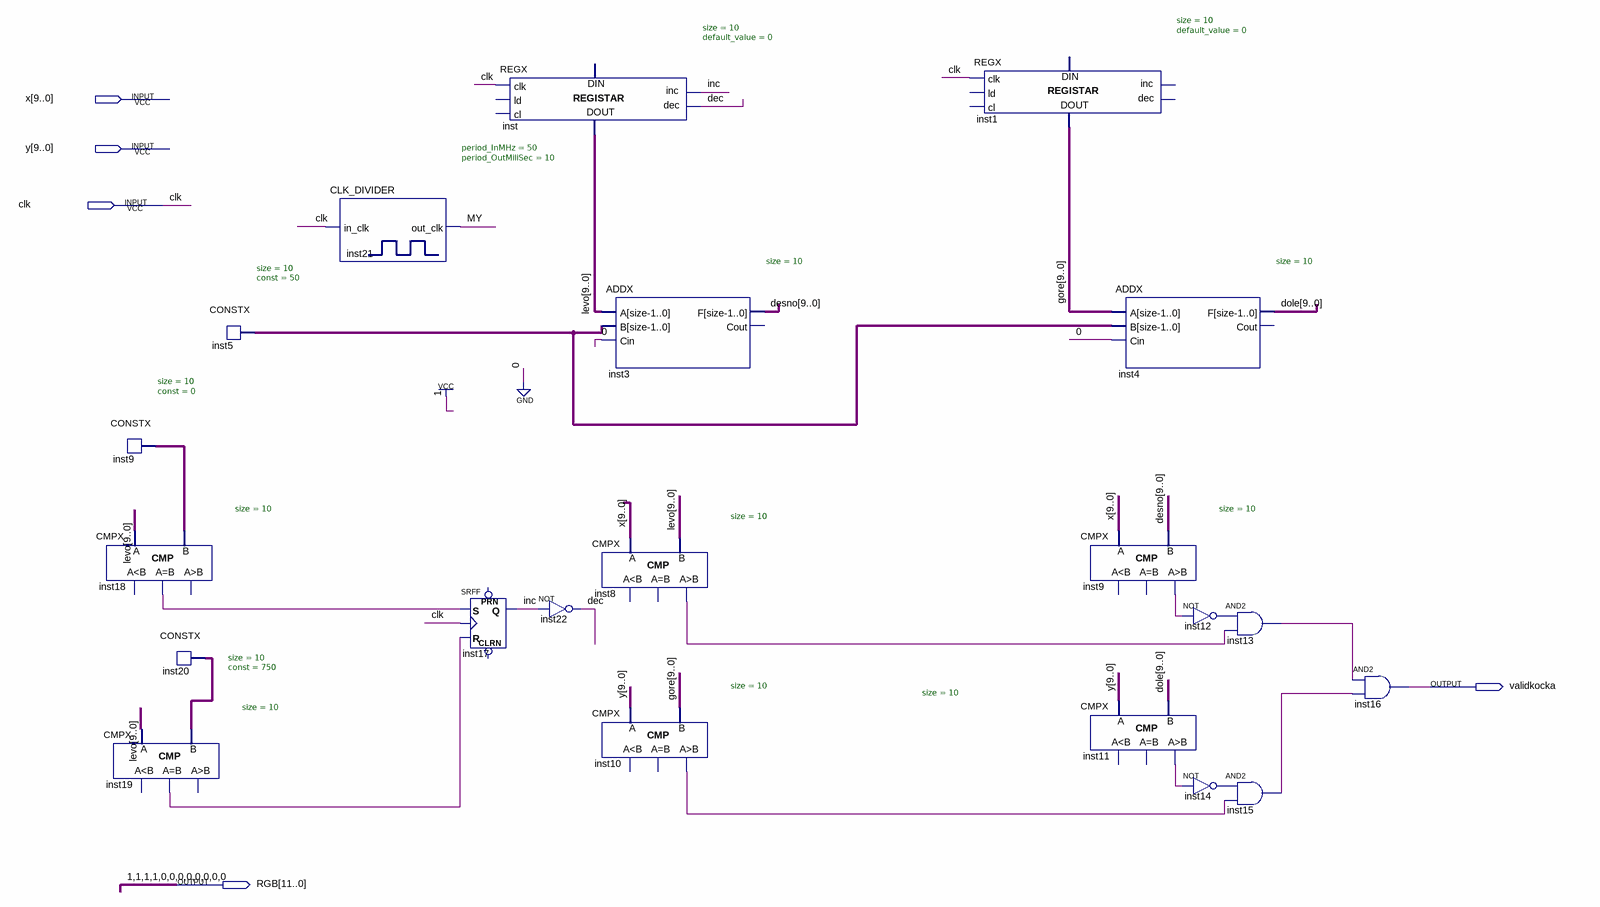
[diagram p0: schematic sheet]
// Quartus schematic kockalevodesno.bdf as structural Verilog: 21 symbols, 5 pins
module kockalevodesno (
  input  [9:0] x,
  input  [9:0] y,
  input  clk,
  output validkocka,
  output [11:0] RGB
);

  wire dec, inc, inst8_gr, inst9_gr, inst10_gr, inst11_gr, inst12_out, inst13_out, inst14_out, inst15_out,
       inst18_eq, inst19_eq, MY;
  wire [9:0] desno, dole, gore, inst5_data, inst9_data, inst20_data, levo;

  CONSTX #(.size(10), .\const (0)) inst9 (.data(inst9_data));
  CMPX #(.size(10)) inst18 (.A(levo), .B(inst9_data), .eq(inst18_eq));  // open: ls, gr
  CMPX #(.size(10)) inst19 (.B(inst20_data), .eq(inst19_eq));  // open: A, ls, gr
  CONSTX #(.size(10), .\const (750)) inst20 (.data(inst20_data));
  CONSTX #(.size(10), .\const (50)) inst5 (.data(inst5_data));
  CLK_DIVIDER #(.period_InMHz(50), .period_OutMiliSec(10)) inst21 (.in_clk(clk), .out_clk(MY));
  SRFF inst17 (.S(inst18_eq), .R(inst19_eq), .CLK(clk), .Q(inc));  // open: PRN, CLRN
  REGX #(.size(10), .default_value(0)) inst (
    .clk(clk), .inc(inc), .dec(dec), .data_out(levo));  // open: ld, cl, data_in
  not inst22 (dec, inc);
  ADDX #(.size(10)) inst3 (.A(levo), .B(inst5_data), .Cin(1'b0), .F(desno));  // open: Cout
  CMPX #(.size(10)) inst8 (.A(x), .B(levo), .gr(inst8_gr));  // open: ls, eq
  CMPX #(.size(10)) inst10 (.A(y), .B(gore), .gr(inst10_gr));  // open: ls, eq
  REGX #(.size(10), .default_value(0)) inst1 (.clk(clk), .data_out(gore));  // open: ld, cl, inc, dec, data_in
  CMPX #(.size(10)) inst9_dup2 (.A(x), .B(desno), .gr(inst9_gr));  // open: ls, eq
  CMPX #(.size(10)) inst11 (.A(y), .B(dole), .gr(inst11_gr));  // open: ls, eq
  ADDX #(.size(10)) inst4 (.A(gore), .B(inst5_data), .Cin(1'b0), .F(dole));  // open: Cout
  not inst12 (inst12_out, inst9_gr);
  not inst14 (inst14_out, inst11_gr);
  and inst13 (inst13_out, inst12_out, inst8_gr);
  and inst15 (inst15_out, inst14_out, inst10_gr);
  and inst16 (validkocka, inst13_out, inst15_out);

  assign RGB = 12'b111100000000;
endmodule
